# EAGLE schematic untitled (EAGLE 6.5.0)
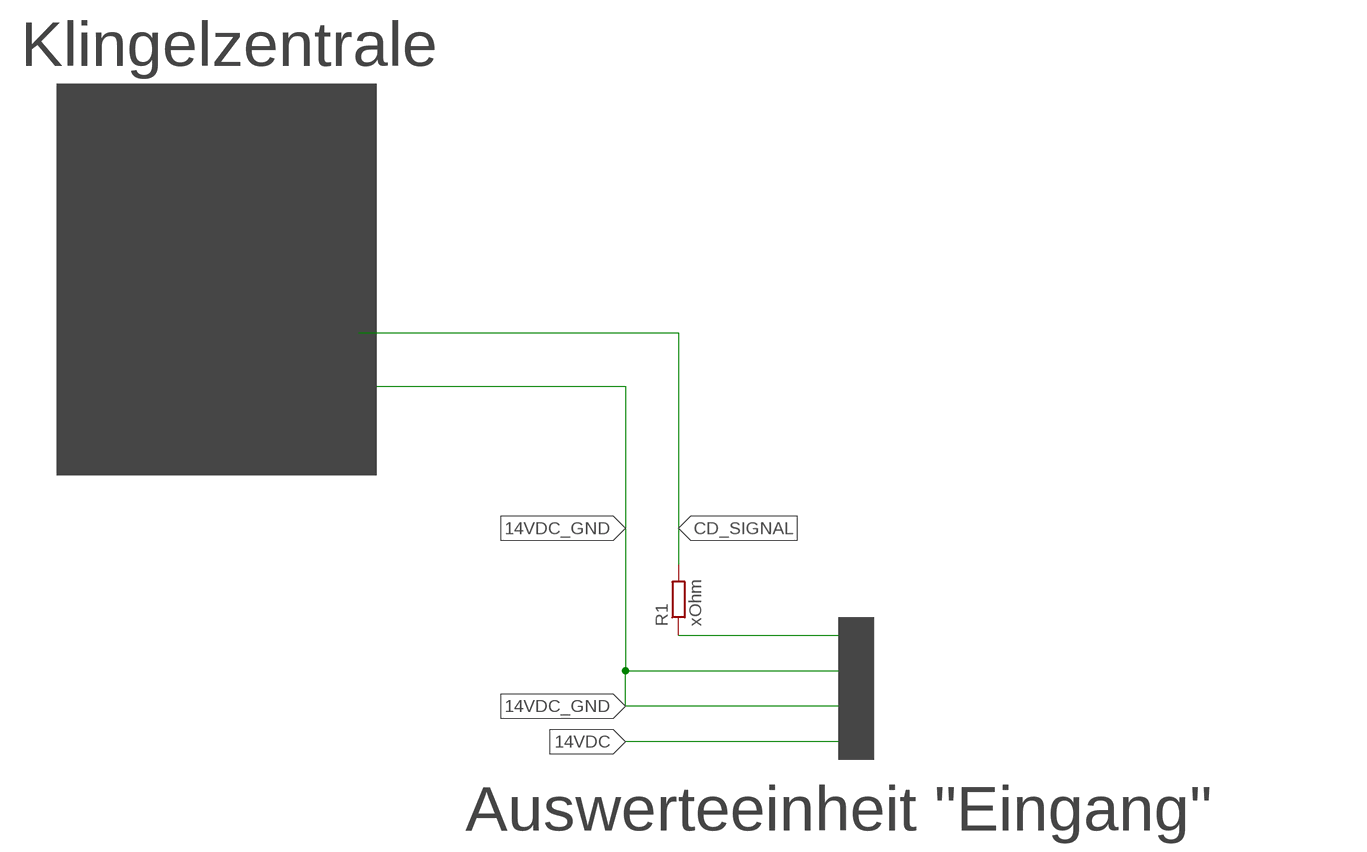
[diagram p0: schematic, sheet 1]

## Parts
R1  xOhm  R-EU_0617/17  [0617/17]

## Nets
CD_SIGNAL: R1.2
N$1: R1.1

## Notes on the sheet
- Klingelzentrale
- Auswerteeinheit "Eingang"

## Library data of the parts
R1 = rcl:R-EU_: RESISTOR, European symbol